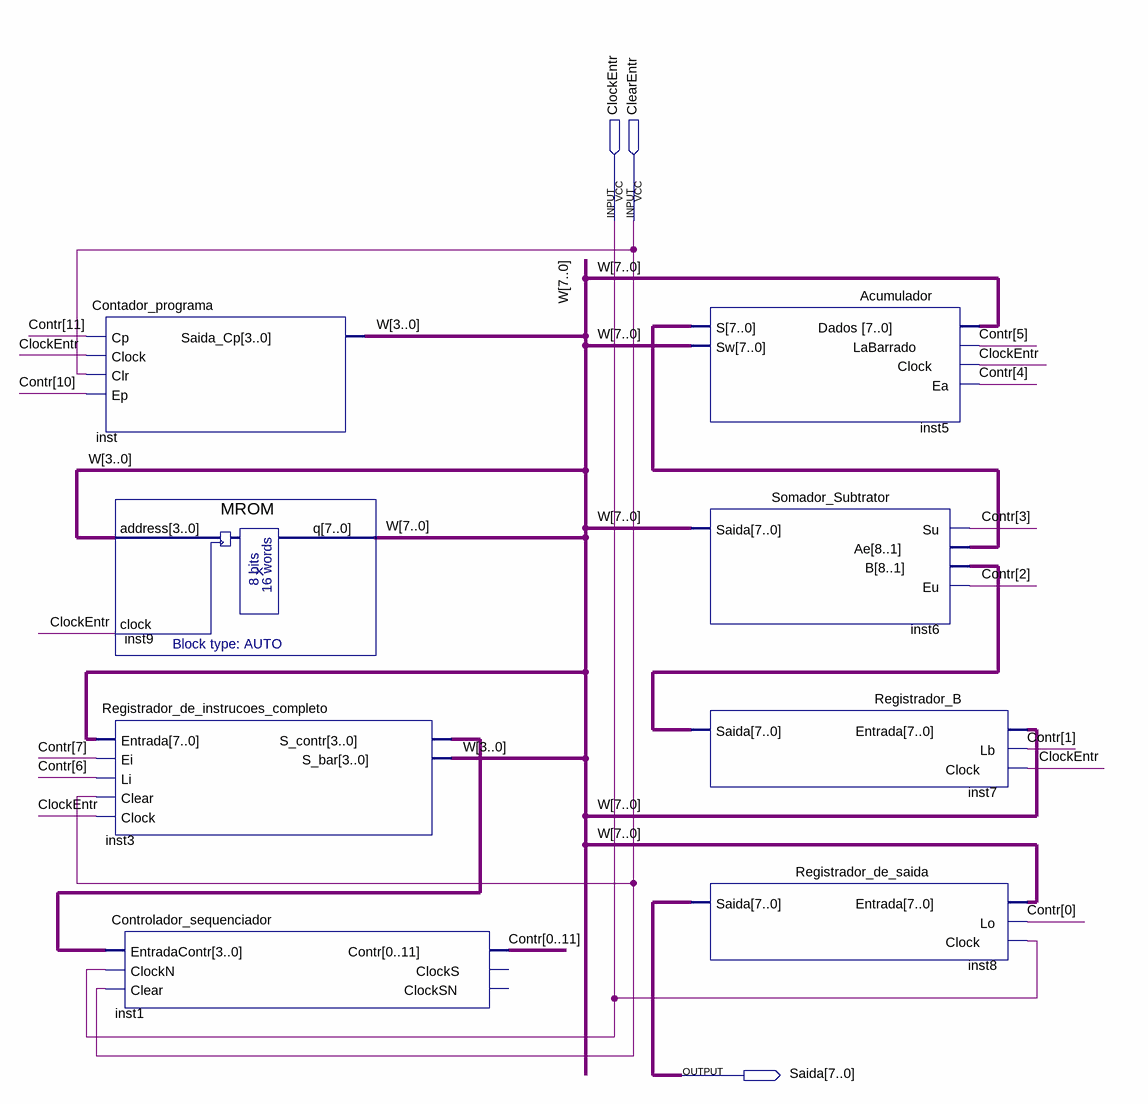
[diagram p0: schematic sheet]
// Quartus schematic Projeto_Final.bdf as structural Verilog: 8 symbols, 3 pins
module Projeto_Final (
  input  ClockEntr,
  input  ClearEntr,
  output [7:0] Saida
);

  wire [3:0] inst3_s_contr;
  wire [7:0] inst5_s, inst7_saida, W;
  wire [11:0] Contr;

  Contador_programa inst (.Cp(Contr[11]), .Clock(ClockEntr), .Clr(ClearEntr), .Ep(Contr[10]), .Saida_Cp(W[3:0]));
  MROM inst9 (.address(W[3:0]), .clock(ClockEntr), .q(W));
  Registrador_de_instrucoes_completo inst3 (
    .Entrada(W), .Ei(Contr[7]), .Li(Contr[6]), .Clear(ClearEntr), .Clock(ClockEntr), .S_contr(inst3_s_contr),
    .S_bar(W[3:0]));
  Controlador_sequenciador inst1 (
    .EntradaContr(inst3_s_contr), .ClockN(ClockEntr), .Clear(ClearEntr),
    .Contr({Contr[0], Contr[1], Contr[2], Contr[3], Contr[4], Contr[5], Contr[6], Contr[7], Contr[8], Contr[9], Contr[10], Contr[11]}));  // open: ClockS, ClockSN
  Acumulador inst5 (.Dados(W), .LaBarrado(Contr[5]), .Clock(ClockEntr), .Ea(Contr[4]), .S(inst5_s), .Sw(W));
  Somador_Subtrator inst6 (.Su(Contr[3]), .Ae(inst5_s), .B(inst7_saida), .Eu(Contr[2]), .Saida(W));
  Registrador_B inst7 (.Entrada(W), .Lb(Contr[1]), .Clock(ClockEntr), .Saida(inst7_saida));
  Registrador_de_saida inst8 (.Entrada(W), .Lo(Contr[0]), .Clock(ClockEntr), .Saida(Saida));
endmodule
